# EAGLE design Testboard_1.3 (EAGLE 9.1.2)
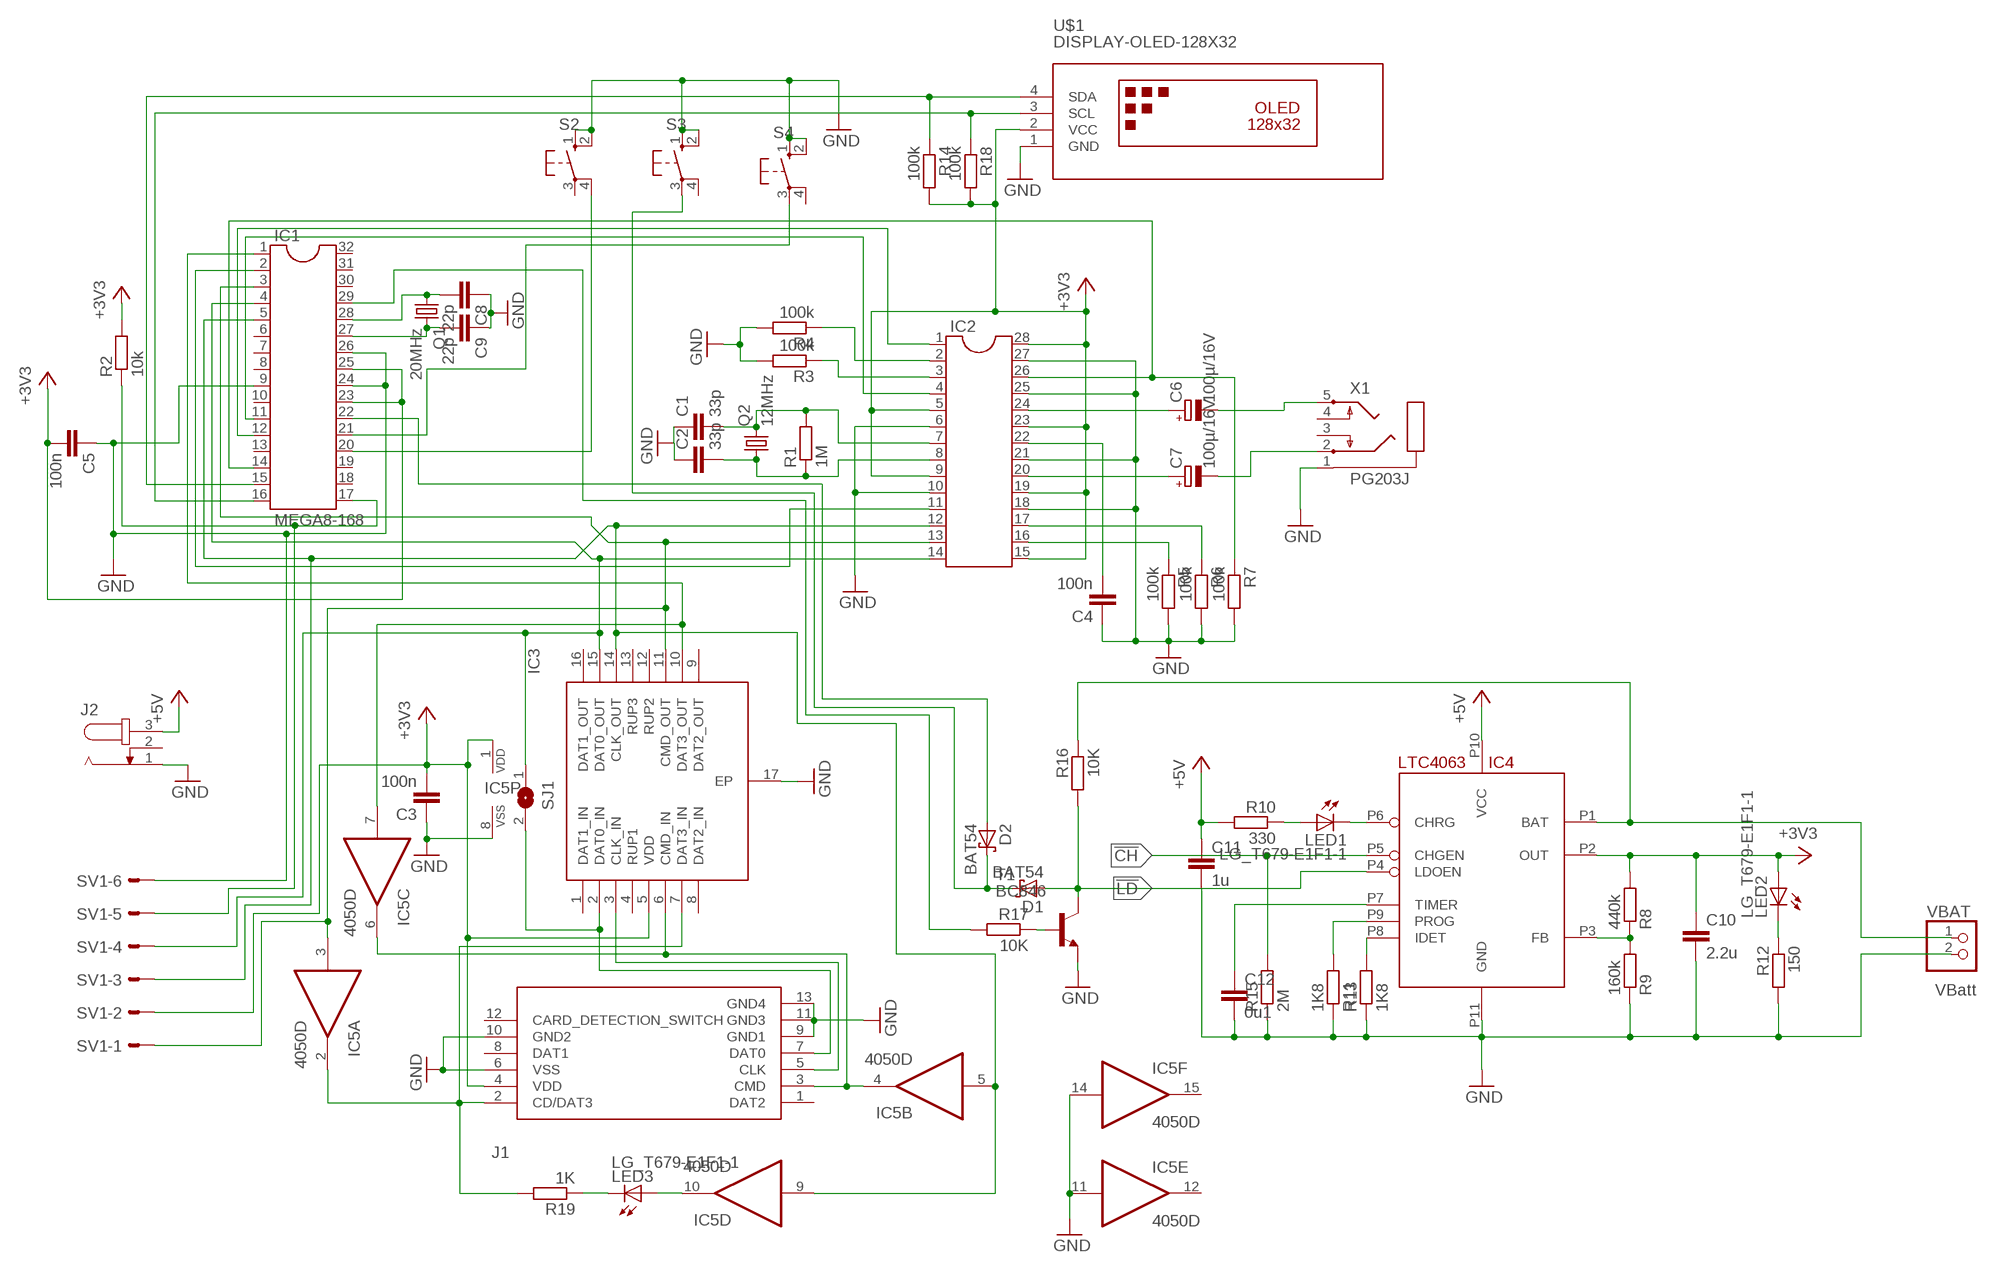
[diagram p0: schematic, sheet 1]

## Parts
C1  33p  C-EUC1206K  [C1206K]
C2  33p  C-EUC1206K  [C1206K]
C3  100n  C-EUC1206K  [C1206K]
C4  100n  C-EUC1206K  [C1206K]
C5  100n  C-EUC1206K  [C1206K]
C6  100µ/16V  CPOL-EUUD-6,3X7,7  [UD-6,3X7,7_NICHICON]
C7  100µ/16V  CPOL-EUUD-6,3X7,7  [UD-6,3X7,7_NICHICON]
C8  22p  C-EUC1206K  [C1206K]
C9  22p  C-EUC1206K  [C1206K]
C10  2.2u  C-EUC0805K  [C0805K]
C11  1u  C-EUC0805K  [C0805K]
C12  0u1  C-EUC0805K  [C0805K]
D1  BAT54  [SOT23]
D2  BAT54  [SOT23]
IC1  MEGA8-168  DIL32  [DIL32]
IC2  DIL28-3  [DIL28-3]
IC3  ECLAMP2410P.TCT  [SON50P160X400X65-17N]
IC4  LTC4063  [LTC4063]
IC5  4050D  [SO16]
J1  DM3CS-SF  [DM3CS-SF]
J2  JACK-PLUG0  [SPC4077]
LED1  LG_T679-E1F1-1  LED5MM  [LED5MM]
LED2  LG_T679-E1F1-1  LED5MM  [LED5MM]
LED3  LG_T679-E1F1-1  LED5MM  [LED5MM]
Q1  20MHz  CRYSTALHC49UP  [HC49UP]
Q2  12MHz  CRYSTALHC49UP  [HC49UP]
R1  1M  R-EU_R0805  [R0805]
R2  10k  R-EU_0207/10  [0207/10]
R3  100k  R-EU_R1206  [R1206]
R4  100k  R-EU_R1206  [R1206]
R5  100k  R-EU_R0805  [R0805]
R6  100k  R-EU_R0805  [R0805]
R7  100k  R-EU_R1206  [R1206]
R8  440k  R-EU_R0805  [R0805]
R9  160k  R-EU_R0805  [R0805]
R10  330  R-EU_R0805  [R0805]
R11  1K8  R-EU_R0805  [R0805]
R12  150  R-EU_R0805  [R0805]
R13  1K8  R-EU_R1206  [R1206]
R14  100k  R-EU_R1206  [R1206]
R15  2M  R-EU_R0805  [R0805]
R16  10K  R-EU_0207/10  [0207/10]
R17  10K  R-EU_R0805  [R0805]
R18  100k  R-EU_R1206  [R1206]
R19  1K  R-EU_R1206  [R1206]
S2  10-XX  [B3F-10XX]
S3  10-XX  [B3F-10XX]
S4  10-XX  [B3F-10XX]
SJ1  SJ  [SJ]
SV1  ML6E  [ML6]
T1  BC846  [SOT23]
U$1  DISPLAY-OLED-128X32  [DISPLAY-OLED-128X32]
VBAT  PINHD-1X2  [1X02]
X1  PG203J  [PG203J]

## Nets
!CH: IC4.P5(CHGEN) R15.2
!LD: D1.1(A) IC4.P4(LDOEN) R16.2 T1.3(C)
+3V3: C3.2 C5.2 C10.1 IC1.23 IC1.25 IC2.5 IC2.9 IC2.15 IC2.19 IC2.23 IC2.28 IC3.5(VDD) IC4.P2(OUT) IC5.1(P:VDD) J1.4(VDD) LED2.A R2.2 R8.2 R14.2 R18.2 SV1.2 U$1.2(VCC)
+5V: C11.1 IC4.P10(VCC) J2.3 R10.2
GND: C1.1 C2.1 C3.1 C4.1 C5.1 C8.1 C9.1 C10.2 C11.2 C12.2 IC1.9 IC1.24 IC1.26 IC2.6 IC2.10 IC2.18 IC2.21 IC2.25 IC2.27 IC3.17(EP) IC4.P11(GND) IC5.8(P:VSS) IC5.11(E:I) IC5.14(F:I) J1.6(VSS) J1.9(GND1) J1.10(GND2) J1.11(GND3) J1.13(GND4) J2.1 R3.2 R4.2 R5.2 R6.2 R7.2 R9.1 R11.1 R12.2 R13.1 R15.1 S2.1(S) S2.2(S1) S3.1(S) S3.2(S1) S4.1(S) S4.2(S1) SV1.6 T1.2(E) U$1.1(GND) VBAT.2 X1.1
N$2: IC1.4 IC2.14 IC3.15(DAT0_OUT) SJ1.1 SV1.4
N$3: IC1.5 IC2.12 IC3.14(CLK_OUT) IC5.5(B:I) IC5.9(D:I) SV1.3
N$5: IC1.2 IC2.11
N$6: C2.2 IC2.8 Q2.1 R1.1
N$7: IC1.11 IC2.4
N$8: C4.2 IC2.22
N$9: IC2.3 R3.1
N$10: C1.2 IC2.7 Q2.2 R1.2
N$11: IC2.2 R4.1
N$12: IC1.20 S2.4(P1)
N$13: IC2.17 R6.1
N$14: IC2.16 R5.1
N$15: IC1.12 IC2.1
N$16: D2.1(A) IC1.22
N$17: IC1.14 IC2.26 R7.1
N$18: IC5.10(D:O) LED3.A
N$19: C7.+ IC2.20
N$20: C6.+ IC2.24
N$21: IC1.21 S4.3(P)
N$22: C6.- X1.5
N$23: C7.- X1.2
N$24: C8.2 IC1.28 Q1.1
N$25: C9.2 IC1.27 Q1.2
N$26: LED3.K(C) R19.1
N$27: IC1.17 R2.1 SV1.5
N$28: IC4.P3(FB) R8.1 R9.2
N$29: IC3.7(DAT3_IN) IC5.2(A:O) J1.2(CD/DAT3) R19.2
N$30: IC3.2(DAT0_IN) J1.7(DAT0) SJ1.2
N$31: IC3.3(CLK_IN) J1.5(CLK)
N$32: IC3.6(CMD_IN) IC5.4(B:O) IC5.6(C:O) J1.3(CMD)
N$33: IC4.P1(BAT) R16.1 VBAT.1
N$34: LED1.A R10.1
N$35: IC4.P9(PROG) R11.2
N$36: IC4.P6(CHRG) LED1.K(C)
N$37: LED2.K(C) R12.1
N$38: IC4.P8(IDET) R13.2
N$39: C12.1 IC4.P7(TIMER)
N$40: IC1.15 R14.1 U$1.4(SDA)
N$41: IC1.16 R18.1 U$1.3(SCL)
N$42: IC1.3 IC2.13 IC3.11(CMD_OUT) IC5.3(A:I) SV1.1
N$43: IC1.1 IC3.10(DAT3_OUT) IC5.7(C:I)
N$47: R17.1 T1.1(B)
N$49: IC1.29 R17.2
N$51: D1.3(C) D2.3(C) S3.3(P)
Unconnected: IC1.6 IC1.7 IC1.8 IC1.10 IC1.13 IC1.18 IC1.19 IC1.30 IC1.31 IC1.32 IC3.1(DAT1_IN) IC3.4(RUP1) IC3.8(DAT2_IN) IC3.9(DAT2_OUT) IC3.12(RUP2) IC3.13(RUP3) IC3.16(DAT1_OUT) IC5.12(E:O) IC5.15(F:O) J1.1(DAT2) J1.8(DAT1) J1.12(CARD_DETECTION_SWITCH) J2.2 S2.3(P) S3.4(P1) S4.4(P1) X1.3 X1.4

## Notes on the sheet
- VBatt

## Library data of the parts
C1-C5 C10-C12 = rcl:C-EU: CAPACITOR, European symbol
C6 C7 = rcl:CPOL-EU: POLARIZED CAPACITOR, European symbol
C8 C9 = rcl:C-EU: CAPACITOR, European symbol; SPICEPREFIX: C
D1 D2 = diode:BAT54: Schottky Diodes Source: Fairchild .. BAT54.pdf
IC1 = ic-package:DIL32: Dual In Line
IC2 = ic-package:DIL28: Dual In Line
IC3 = SamacSys_Parts:ECLAMP2410P.TCT: EClamp ESD-EMI Protect T-Flash/MicroSD Semtech ECLAMP2410P.TCT, Hex Bi-Directional EMI Filter & ESD Protector, 16-Pin SLP EP Source: Datasheet <http://www.semtech.com/images/datasheet/eclamp2410p.pdf>; ARROW_PART_NUMBER: ECLAMP2410P.TCT; ARROW_PRICE/STOCK: https://www.arrow.com/en/products/eclamp2410p.tct/semtech; DESCRIPTION: EClamp ESD-EMI Protect T-Flash/MicroSD Semtech ECLAMP2410P.TCT, Hex Bi-Directional EMI Filter & ESD Protector, 16-Pin SLP EP; HEIGHT: 0.65mm; MANUFACTURER_NAME: SEMTECH; MANUFACTURER_PART_NUMBER: ECLAMP2410P.TCT; RS_PART_NUMBER: 6910638; RS_PRICE/STOCK: http://uk.rs-online.com/web/p/products/6910638
IC4 = LinearTechnology:LTC4063: LTC4063 - Standalone Linear Li-Ion Charger with Micropower Low Dropout Linear Regulator The LTC®4063 is a standalone linear charger for single cell lithium-ion batteries with an adjustable low dropout linear regulator (LDO). The adjustable LDO regulates an output voltage between 1.2V to 4.2V at up to 100mA load cur- rent. When the input supply (wall adapter or USB supply) is removed, the LDO regulates the output voltage without interruption. The battery charger and LDO regulator can be enabled individually. No external sense resistor or external blocking diode is required for charging due to the internal MOSFET archi- tecture. For more details have a look at the data sheet <http://cds.linear.com/docs/en/datasheet/4063fc.pdf>. Copyright (c) 2013, Michael Hohl <http://www.michaelhohl.net>
IC5 = 40xx:4050: Hex non-inverting BUFFER
J1 = SamacSys_Parts:DM3CS-SF: MicroSD card connector, push-pull type MicroSD card connector, push-pull type Source: Datasheet <http://docs-europe.electrocomponents.com/webdocs/118f/0900766b8118f8bb.pdf>; ARROW_PART_NUMBER: DM3CS-SF; ARROW_PRICE/STOCK: https://www.arrow.com/en/products/dm3cs-sf/hirose-electric; DESCRIPTION: MicroSD card connector, push-pull type MicroSD card connector, push-pull type; HEIGHT: mm; MANUFACTURER_NAME: Hirose; MANUFACTURER_PART_NUMBER: DM3CS-SF; RS_PART_NUMBER: 1664833; RS_PRICE/STOCK: http://uk.rs-online.com/web/p/products/1664833
J2 = con-jack:JACK-PLUG: DC POWER JACK Power Jack, DC, Right Angle, Through Hole, Rated 5A at 16VDC, PC Terminals Distributor: Farnell (www.Farnell.de) Drawing: 84N1161.pdf / 84N1162.pdf Manufacturer: SPC Technology (www.spctechnology.com) Type: SPC4077 / SPC 4078; OC_FARNELL: unknown; OC_NEWARK: unknown
LED1-LED3 = led:LED: LED OSRAM: - CHIPLED LG R971, LG N971, LY N971, LG Q971, LY Q971, LO R971, LY R971 LH N974, LH R974 LS Q976, LO Q976, LY Q976 LO Q996 - Hyper CHIPLED LW Q18S LB Q993, LB Q99A, LB R99A - SideLED LS A670, LO A670, LY A670, LG A670, LP A670 LB A673, LV A673, LT A673, LW A673 LH A674 LY A675 LS A676, LA A676, LO A676, LY A676, LW A676 LS A679, LY A679, LG A679 - Hyper Micro SIDELED® LS Y876, LA Y876, LO Y876, LY Y876 LT Y87S - SmartLED LW L88C, LW L88S LB L89C, LB L89S, LG L890 LS L89K, LO L89K, LY L89K LS L896, LA L896, LO L896, LY L896 - TOPLED LS T670, LO T670, LY T670, LG T670, LP T670 LSG T670, LSP T670, LSY T670, LOP T670, LYG T670 LG T671, LOG T671, LSG T671 LB T673, LV T673, LT T673, LW T673 LH T674 LS T676, LA T676, LO T676, LY T676, LB T676, LH T676, LSB T676, LW T676 LB T67C, LV T67C, LT T67C, LS T67K, LO T67K, LY T67K, LW E67C LS E67B, LA E67B, LO E67B, LY E67B, LB E67C, LV E67C, LT E67C LW T67C LS T679, LY T679, LG T679 LS T770, LO T770, LY T770, LG T770, LP T770 LB T773, LV T773, LT T773, LW T773 LH T774 LS E675, LA E675, LY E675, LS T675 LS T776, LA T776, LO T776, LY T776, LB T776 LHGB T686 LT T68C, LB T68C - Hyper Mini TOPLED® LB M676 - Mini TOPLED Santana® LG M470 LS M47K, LO M47K, LY M47K Source: http://www.osram.convergy.de LUXEON: - LUMILED® LXK2-PW12-R00, LXK2-PW12-S00, LXK2-PW14-U00, LXK2-PW14-V00 LXK2-PM12-R00, LXK2-PM12-S00, LXK2-PM14-U00 LXK2-PE12-Q00, LXK2-PE12-R00, LXK2-PE12-S00, LXK2-PE14-T00, LXK2-PE14-U00 LXK2-PB12-K00, LXK2-PB12-L00, LXK2-PB12-M00, LXK2-PB14-N00, LXK2-PB14-P00, LXK2-PB14-Q00 LXK2-PR12-L00, LXK2-PR12-M00, LXK2-PR14-Q00, LXK2-PR14-R00 LXK2-PD12-Q00, LXK2-PD12-R00, LXK2-PD12-S00 LXK2-PH12-R00, LXK2-PH12-S00 LXK2-PL12-P00, LXK2-PL12-Q00, LXK2-PL12-R00 Source: www.luxeon.com KINGBRIGHT: KA-3528ASYC Source: www.kingbright.com
Q1 = crystal:CRYSTAL: CRYSTAL; OC_FARNELL: unknown; OC_NEWARK: unknown
Q2 = crystal:CRYSTAL: CRYSTAL
R1-R10 R12-R19 = rcl:R-EU_: RESISTOR, European symbol; SPICEPREFIX: R
R11 = rcl:R-EU_: RESISTOR, European symbol
S2-S4 = switch-omron:10-XX: OMRON SWITCH; MPN: B3F-1000; OC_FARNELL: 176432; OC_NEWARK: 36M3542
SJ1 = jumper:SJ: SMD solder JUMPER
SV1 = con-ml:ML6E: HARTING; OC_FARNELL: unknown; OC_NEWARK: unknown
T1 = transistor-neu-to92:BC846: NPN TRANSISTOR
U$1 = diy-modules:DISPLAY-OLED-128X32: 128x32 Dot Matrix OLED Module with I2C interface based on SSD1306 chip More details available here: http://www.tinyosshop.com/index.php?route=product/product&product_id=953 Schematic available here: http://www.tinyosshop.com/datasheet/OLED%2012832.pdf SSD1306 datasheet: https://cdn-shop.adafruit.com/datasheets/SSD1306.pdf Click here to find device on ebay.com <http://www.ebay.com/sch/oled+display+128x32+i2c>
VBAT = pinhead:PINHD-1X2: PIN HEADER
X1 = con-hirschmann:PG203J: MIC/HEADPHONE JACK KS-S stereo microphone/headphone jack PG203JN (Schukat); OC_FARNELL: unknown; OC_NEWARK: unknown

## Board
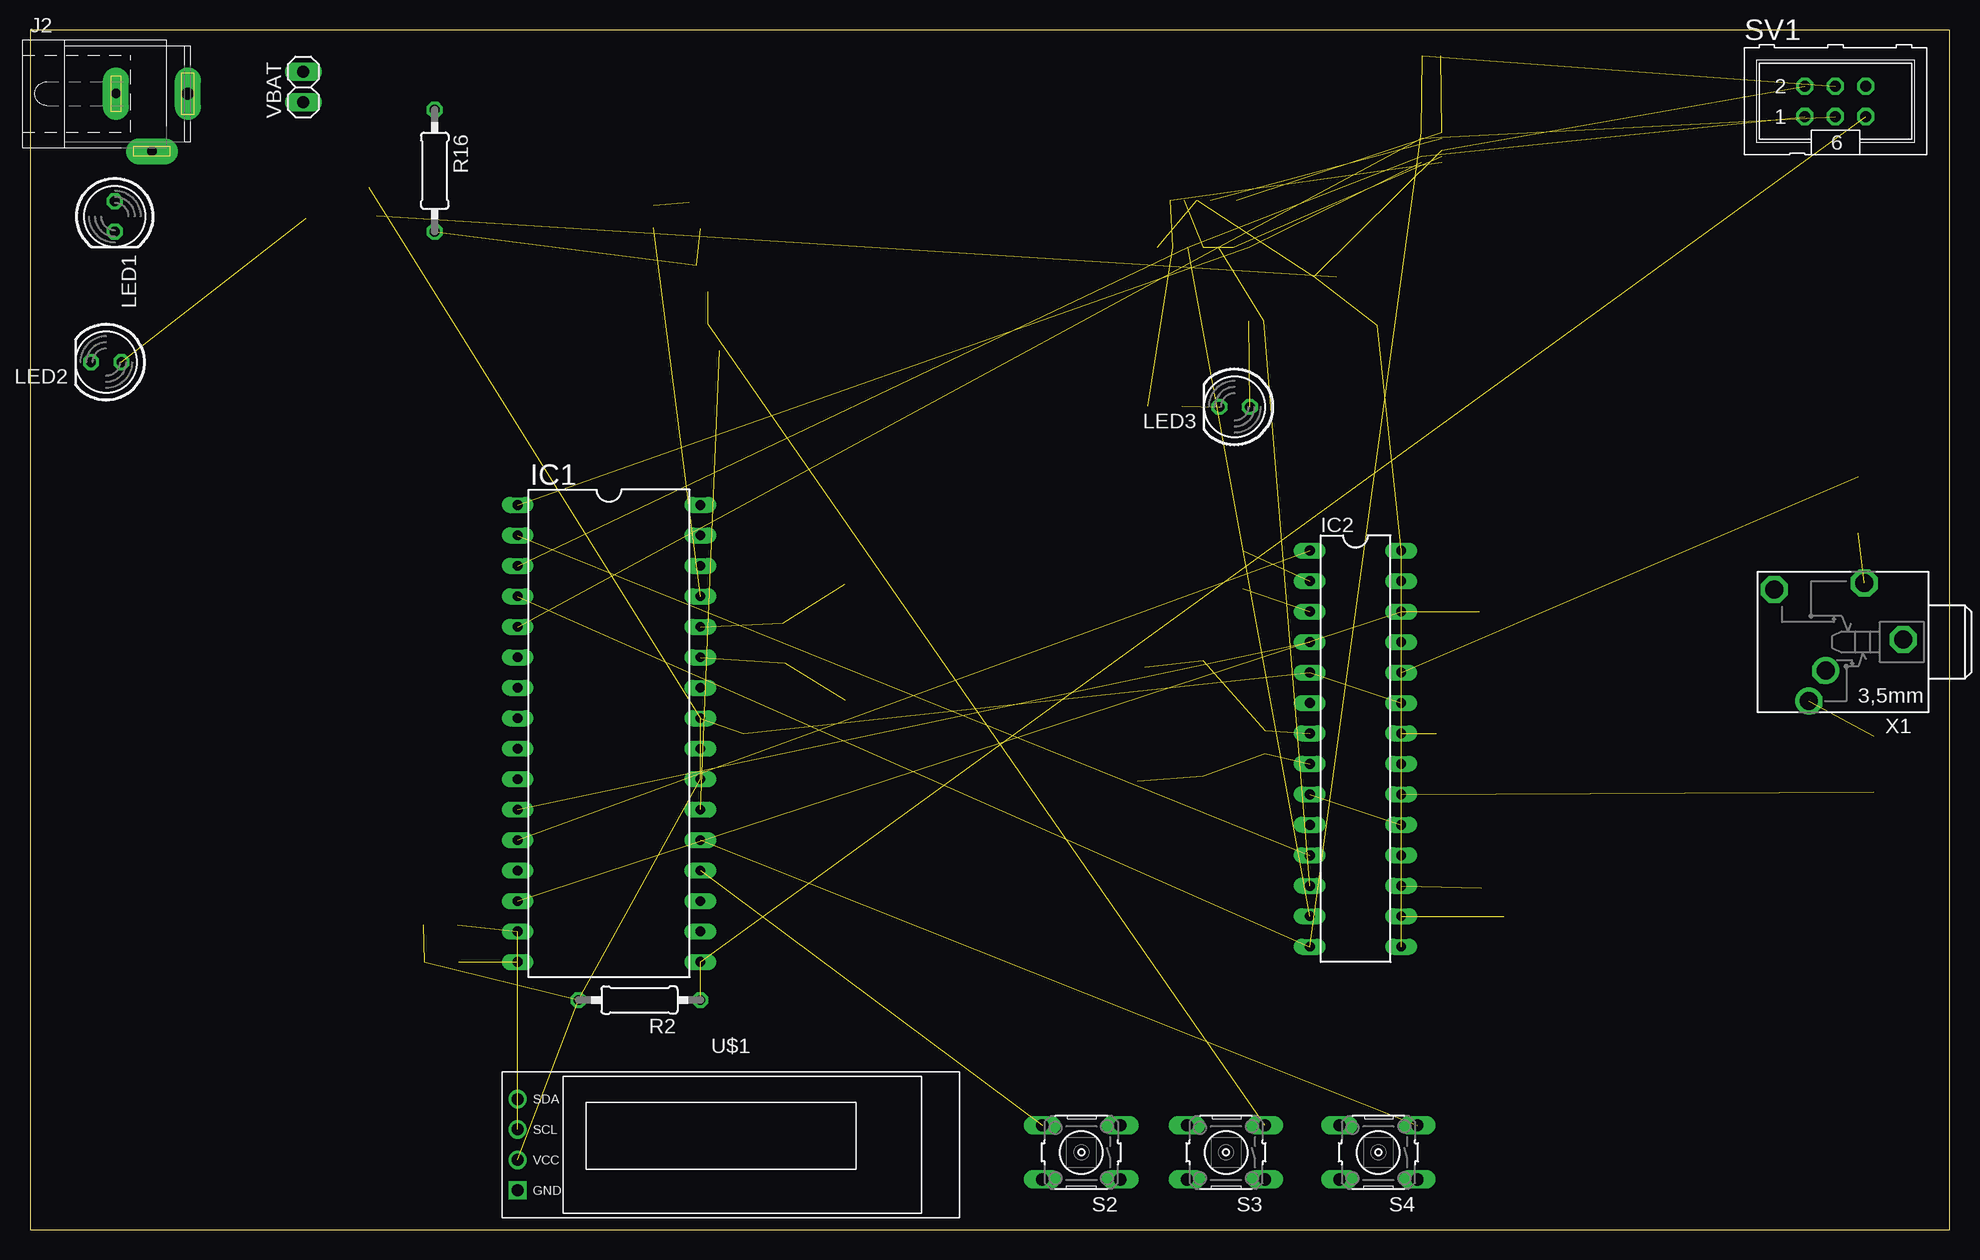
[diagram p1: board, top side]
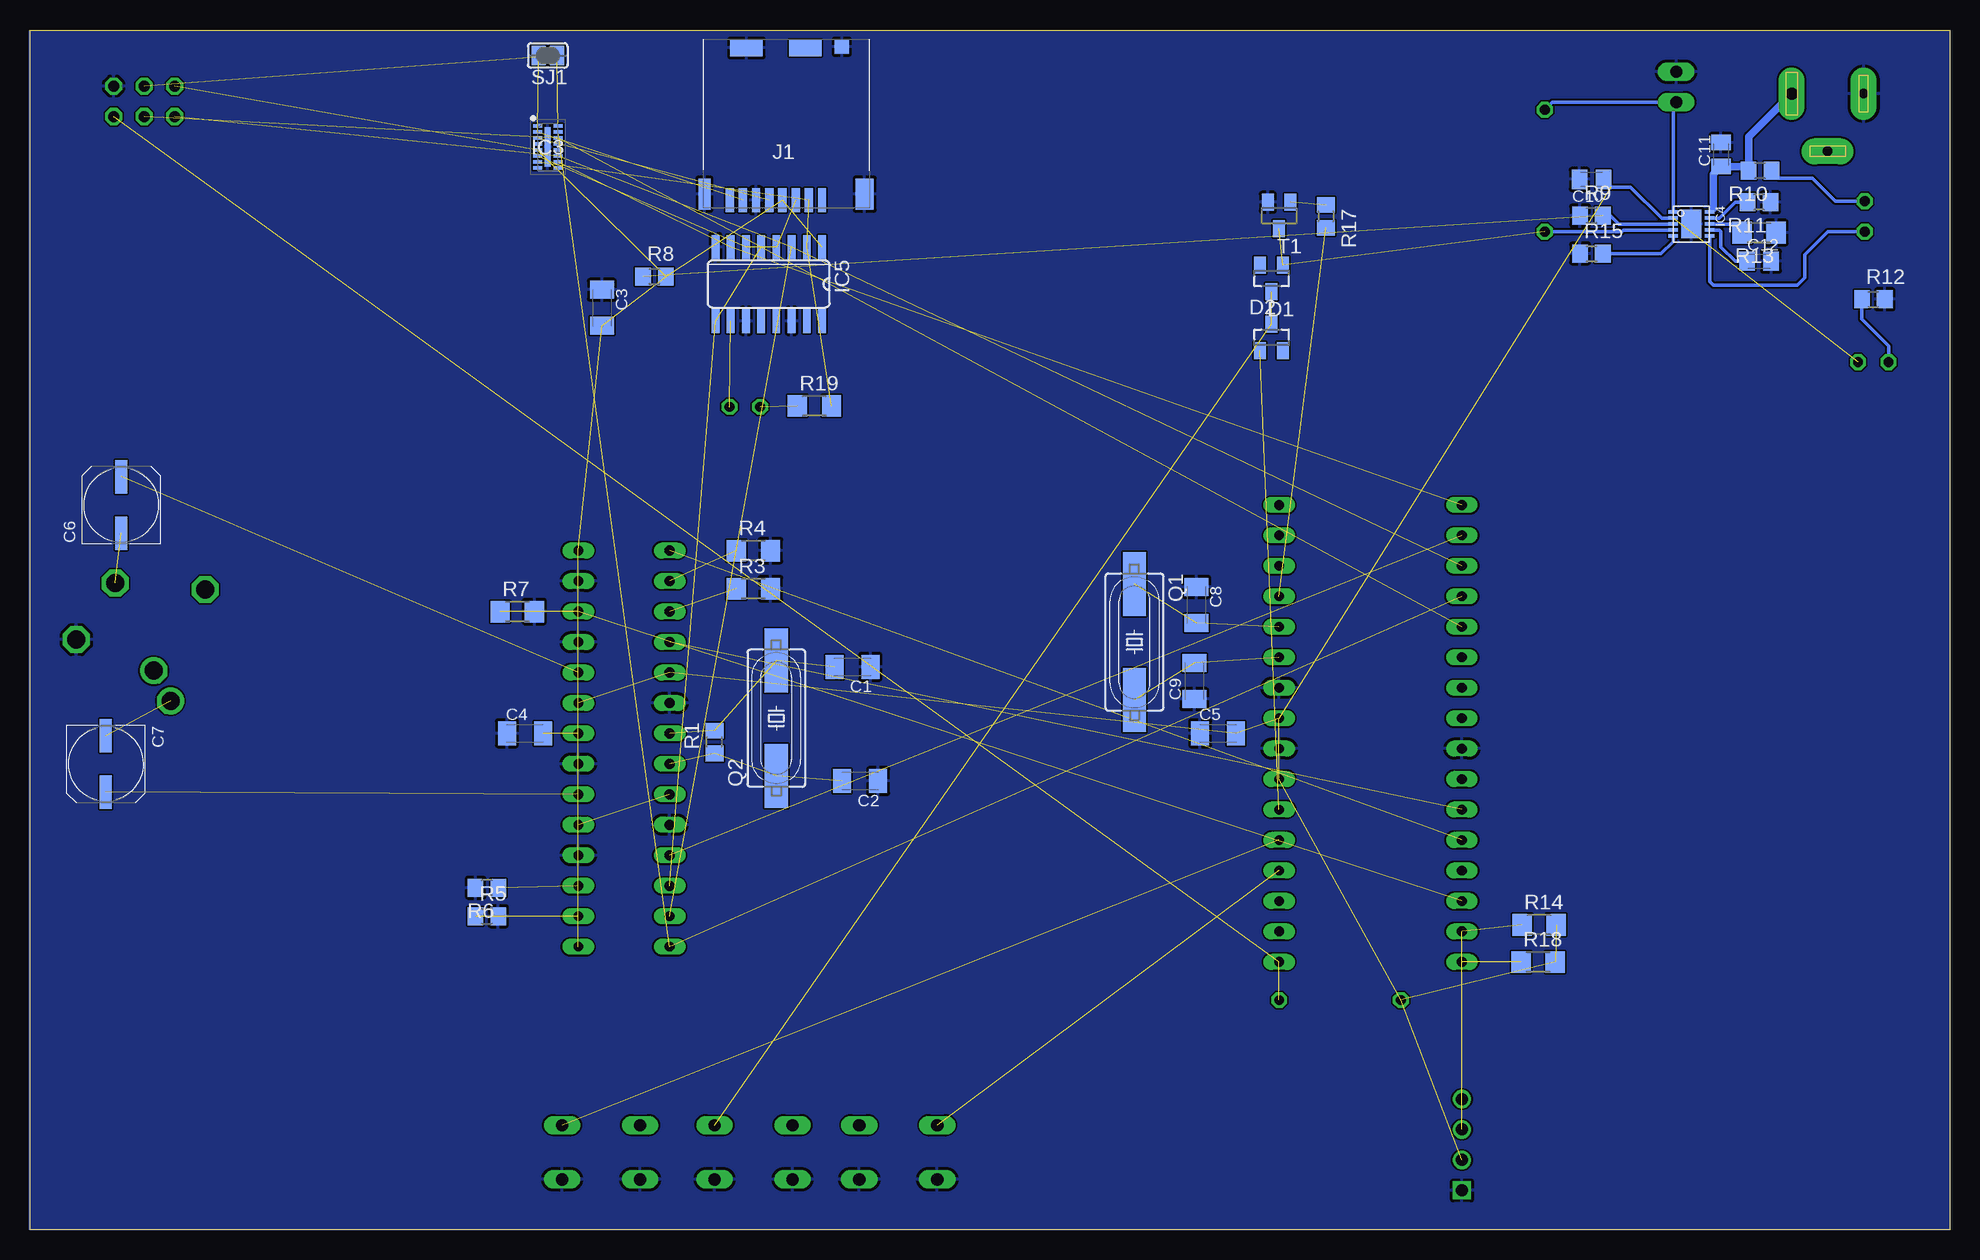
[diagram p2: board, bottom side, seen from below]

Size 160 x 100 mm. Coordinates in mm from the lower left corner, seen from the top.
Outline: 0,0 160,0 160,100 0,100 0,0
Copper layers (1*16): Top 0.035mm / dielectric 1.5mm / Bottom 0.035mm
Design rules "default *": minimum track width 6mil, minimum drill 0.35mm, track to track 6mil, track to pad 6mil, pad to pad 6mil, via to via 6mil, smd to smd 6mil, copper to edge 0mil, drill to drill 6mil, minimum pad ring 10mil, minimum via ring 8mil, stop-mask expansion 4mil, vias tented up to drill 0mil, thermal gap 10mil

### Footprints (pad centres in the part's own frame; a part is rotated, then mirrored left to right if it is on the bottom)
C1206K = smd 1.5 x 2: 1 -1.5,0; 2 1.5,0
UD-6,3X7,7_NICHICON = smd 2.8 x 1: + 2.35,0; - -2.35,0
C0805K = smd 1.3 x 1.6: 1 -1,0; 2 1,0
SOT23 = smd 1 x 1.4: 1 -0.95,-1.1; 2 0.95,-1.1; 3 0,1.1
DIL32 = drill 0.813 long: 1 -19.05,-7.62; 2 -16.51,-7.62; 3 -13.97,-7.62; 4 -11.43,-7.62; 5 -8.89,-7.62; 6 -6.35,-7.62; 7 -3.81,-7.62; 8 -1.27,-7.62; 9 1.27,-7.62; 10 3.81,-7.62; 11 6.35,-7.62; 12 8.89,-7.62; 13 11.43,-7.62; 14 13.97,-7.62; 15 16.51,-7.62; 16 19.05,-7.62; 17 19.05,7.62; 18 16.51,7.62; 19 13.97,7.62; 20 11.43,7.62; 21 8.89,7.62; 22 6.35,7.62; 23 3.81,7.62; 24 1.27,7.62; 25 -1.27,7.62; 26 -3.81,7.62; 27 -6.35,7.62; 28 -8.89,7.62; 29 -11.43,7.62; 30 -13.97,7.62; 31 -16.51,7.62; 32 -19.05,7.62
DIL28-3 = drill 0.813 long: 1 -16.51,-3.81; 2 -13.97,-3.81; 3 -11.43,-3.81; 4 -8.89,-3.81; 5 -6.35,-3.81; 6 -3.81,-3.81; 7 -1.27,-3.81; 8 1.27,-3.81; 9 3.81,-3.81; 10 6.35,-3.81; 11 8.89,-3.81; 12 11.43,-3.81; 13 13.97,-3.81; 14 16.51,-3.81; 15 16.51,3.81; 16 13.97,3.81; 17 11.43,3.81; 18 8.89,3.81; 19 6.35,3.81; 20 3.81,3.81; 21 1.27,3.81; 22 -1.27,3.81; 23 -3.81,3.81; 24 -6.35,3.81; 25 -8.89,3.81; 26 -11.43,3.81; 27 -13.97,3.81; 28 -16.51,3.81
SON50P160X400X65-17N = smd 0.75 x 0.3: 1 -0.85,1.75; 2 -0.85,1.25; 3 -0.85,0.75; 4 -0.85,0.25; 5 -0.85,-0.25; 6 -0.85,-0.75; 7 -0.85,-1.25; 8 -0.85,-1.75; 9 0.85,-1.75; 10 0.85,-1.25; 11 0.85,-0.75; 12 0.85,-0.25; 13 0.85,0.25; 14 0.85,0.75; 15 0.85,1.25; 16 0.85,1.75 | smd 0.5 x 3.3: 17 0,0
LTC4063 = smd 0.3 x 0.8: P1 -1,-1.525; P2 -0.5,-1.525; P3 0,-1.525; P4 0.5,-1.525; P5 1,-1.525; P6 1,1.525; P7 0.5,1.525; P8 0,1.525; P9 -0.5,1.525; P10 -1,1.525 | smd 2.38 x 1.65: P11 0,0
SO16 = smd 0.66 x 2.032: 1 -4.445,-3.073; 2 -3.175,-3.073; 3 -1.905,-3.073; 4 -0.635,-3.073; 5 0.635,-3.073; 6 1.905,-3.073; 7 3.175,-3.073; 8 4.445,-3.073; 9 4.445,3.073; 10 3.175,3.073; 11 1.905,3.073; 12 0.635,3.073; 13 -0.635,3.073; 14 -1.905,3.073; 15 -3.175,3.073; 16 -4.445,3.073
DM3CS-SF = smd 0.7 x 2: 1 0,0; 2 -1.1,0; 3 -2.2,0; 4 -3.3,0; 5 -4.4,0; 6 -5.5,0; 7 -6.6,0; 8 -7.7,0 | smd 1 x 2.6: 9 -9.8,0.5 | smd 1.5 x 2.6: 10 3.55,0.5 | smd 1.2 x 1.2: 11 1.65,12.8 | smd 2.7 x 1.4: 12 -1.4,12.7; 13 -6.3,12.7
SPC4077 = drill 0.8 pad 2.184 long: 1 -3,0; 2 0,-4.8 | drill 1 pad 2.184 long: 3 3,0
LED5MM = drill 0.813 octagon: A -1.27,0; K 1.27,0
HC49UP = smd 5.334 x 1.93: 1 -4.826,0; 2 4.826,0
R0805 = smd 1.3 x 1.5: 1 -0.95,0; 2 0.95,0
0207/10 = drill 0.813 octagon: 1 -5.08,0; 2 5.08,0
R1206 = smd 1.6 x 1.803: 1 -1.422,0; 2 1.422,0
B3F-10XX = drill 1.016 long: 1 -3.251,2.261; 2 3.251,2.261; 3 -3.251,-2.261; 4 3.251,-2.261
SJ = smd 1.168 x 1.6: 1 -0.762,0; 2 0.762,0
ML6 = drill 0.914 octagon: 1 -2.54,-1.27; 2 -2.54,1.27; 3 0,-1.27; 4 0,1.27; 5 2.54,-1.27; 6 2.54,1.27
DISPLAY-OLED-128X32 = drill 1 square: 1 -17.78,-3.81 | drill 1: 2 -17.78,-1.27; 3 -17.78,1.27; 4 -17.78,3.81
1X02 = drill 1.016 long: 1 -1.27,0; 2 1.27,0
PG203J = drill 1.499 octagon: 1 -5.004,-0.203; 4 5.74,-4.369; 5 -1.753,-4.902 | drill 1.499: 2 2.845,4.902; 3 1.448,2.388

### Placement (x,y rotation side)
C1  91.44,46.91 180 bottom
C2  90.81,37.38 180 bottom
C3  112.31,76.83 270 bottom
C4  118.75,41.35 0 bottom
C5  60.96,41.35 0 bottom
C6  152.4,60.41 90 bottom
C7  153.67,38.81 270 bottom
C8  62.78,52.07 270 bottom
C9  62.95,45.72 90 bottom
C10  29.84,87.55 180 bottom
C11  19.05,89.61 90 bottom
C12  15.88,80.72 0 bottom
D1  56.52,79.3 180 bottom
D2  56.52,74.38 0 bottom
IC1  48.26,41.35 270 top
IC2  110.49,40.09 270 top
IC3  116.84,90.25 0 bottom
IC4  21.51,83.82 270 bottom
IC5  98.42,78.82 180 bottom
J1  93.98,85.81 0 bottom
J2  10.16,94.69 0 top
LED1  7.07,84.45 270 top
LED2  6.35,72.31 180 top
LED3  100.41,68.58 180 top
Q1  67.94,48.98 270 bottom
Q2  97.79,42.62 90 bottom
R1  102.95,40.64 90 bottom
R2  50.8,19.13 180 top
R3  99.69,53.42 0 bottom
R4  99.69,56.59 0 bottom
R5  121.92,26.11 0 bottom
R6  121.92,28.5 180 bottom
R7  119.38,51.52 0 bottom
R8  107.95,79.45 0 bottom
R9  29.84,84.53 0 bottom
R10  15.79,88.27 180 bottom
R11  15.88,85.64 180 bottom
R12  6.35,77.55 0 bottom
R13  15.88,83.11 180 bottom
R14  34.21,25.4 0 bottom
R15  29.84,81.36 0 bottom
R16  33.73,88.27 270 top
R17  51.99,84.45 270 bottom
R18  34.29,22.3 0 bottom
R19  94.61,68.66 0 bottom
S2  87.63,6.43 180 top
S3  99.69,6.43 180 top
S4  112.39,6.43 180 top
SJ1  116.84,97.87 180 bottom
SV1  150.5,94.06 0 top
T1  55.88,84.53 180 bottom
U$1  58.42,7.07 0 top
VBAT  22.78,95.25 90 top
X1  151.13,48.98 180 top

### Tracks (layer width: path | path; a pad name or v marks a point on that pad's centre or on a via)
!CH
  Bottom 0.305: IC4.P5 23.04,82.38 24.05,81.36 R15.2
!LD  (2 unrouted)
  Bottom 0.305: IC4.P4 27.17,83.32 27.3,83.19 R16.2
+3V3  (20 unrouted)
  Bottom 0.305: IC4.P2 24,84.32 26.59,86.92 28.21,86.92 C10.1
+5V
  Bottom 0.305: IC4.P10 19.71,85.09 19.68,85.09
  Bottom 0.61: 19.68,85.09 19.68,87.98 C11.1 17.09,88.61 R10.2 16.75,91.11 J2.3
GND  (via drill 1 pad 2.1)
  other vias: 156.08,49.23
  pour Bottom: 0,0 160.02,0 160.02,99.95 0,99.95
N$1  (via drill 1 pad 2.1)
  other vias: 145.41,53.42
N$2  (4 unrouted)
N$3  (5 unrouted)
N$4  (via drill 1 pad 2.1)
  other vias: 149.61,46.56
N$5  (1 unrouted)
N$6  (3 unrouted)
N$7  (1 unrouted)
N$8  (1 unrouted)
N$9  (1 unrouted)
N$10  (3 unrouted)
N$11  (1 unrouted)
N$12  (1 unrouted)
N$13  (1 unrouted)
N$14  (1 unrouted)
N$15  (1 unrouted)
N$16  (1 unrouted)
N$17  (2 unrouted)
N$18  (1 unrouted)
N$19  (1 unrouted)
N$20  (1 unrouted)
N$21  (1 unrouted)
N$22  (via drill 1 pad 2.1)  (2 unrouted)
  other vias: 152.91,53.93
N$23  (via drill 1 pad 2.1)  (2 unrouted)
  other vias: 148.34,44.02
N$24  (2 unrouted)
N$25  (2 unrouted)
N$26  (1 unrouted)
N$27  (2 unrouted)
N$28  (1 unrouted)
  Bottom 0.305: IC4.P3 27.55,83.82 28.26,84.53 R9.2
N$29  (3 unrouted)
N$30  (2 unrouted)
N$31  (1 unrouted)
N$32  (3 unrouted)
N$33
  Bottom 0.305: IC4.P1 23.04,93.72 VBAT.1 33.1,93.98 R16.1
N$34
  Bottom 0.305: LED1.A 9.53,85.72 11.43,87.63 14.21,87.63 R10.1
N$35
  Bottom 0.305: IC4.P9 19.18,84.32 17.86,85.64 R11.2
N$36
  Bottom 0.305: IC4.P6 19.98,79.04 19.68,78.74 12.7,78.74 12.06,79.38 12.06,81.28 10.16,83.19 LED1.K
N$37
  Bottom 0.305: R12.1 7.3,75.88 5.08,73.66 LED2.K
N$38
  Bottom 0.305: IC4.P8 17.3,83.82 R13.2
N$39
  Bottom 0.305: IC4.P7 19.18,83.32 19.05,83.19 19.05,81.92 17.86,80.72 C12.1
N$40  (2 unrouted)
N$41  (2 unrouted)
N$42  (4 unrouted)
N$43  (2 unrouted)
N$47  (1 unrouted)
N$49  (1 unrouted)
N$51  (2 unrouted)